# Altium schematic sheet MCU.SchDoc
size A3
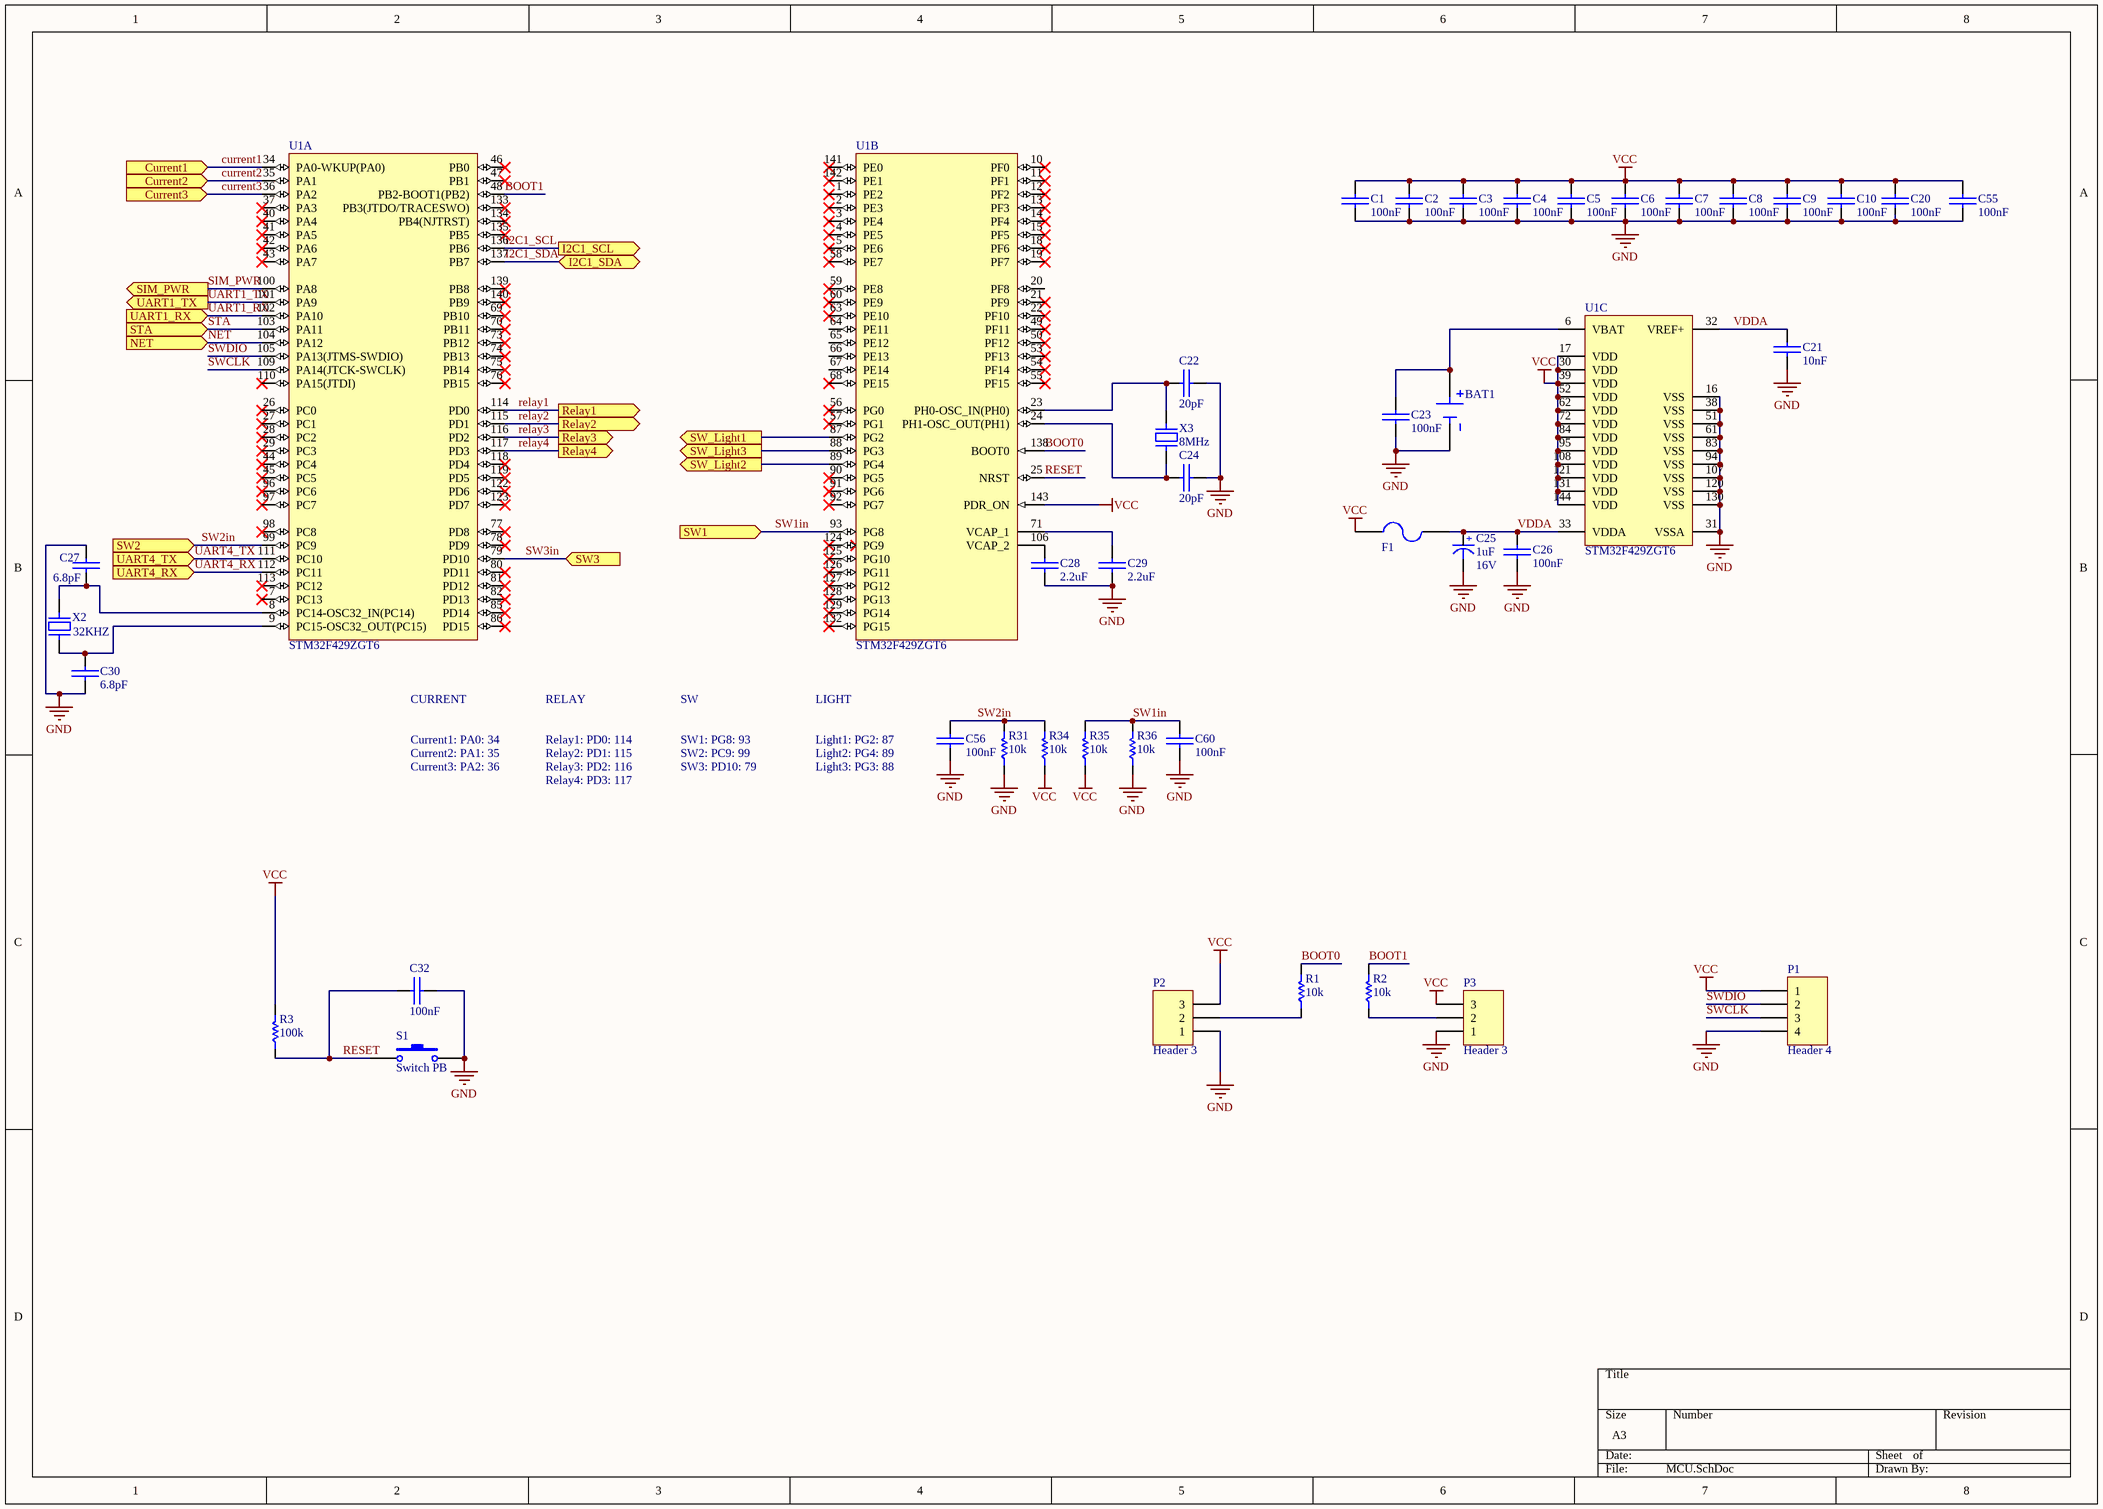
[diagram p0: MCU.SchDoc]

## Parts
BAT1  BAT  [BAT_STAND]  (value not drawn)
C1  100nF  [CAP 0603_1608]
C2  100nF  [CAP 0603_1608]
C3  100nF  [CAP 0603_1608]
C4  100nF  [CAP 0603_1608]
C5  100nF  [CAP 0603_1608]
C6  100nF  [CAP 0603_1608]
C7  100nF  [CAP 0603_1608]
C8  100nF  [CAP 0603_1608]
C9  100nF  [CAP 0603_1608]
C10  100nF  [CAP 0603_1608]
C20  100nF  [CAP 0603_1608]
C21  10nF  [CAP 0603_1608]
C22  20pF  [CAP 0805_2012]
C23  100nF  [CAP 0603_1608]
C24  20pF  [CAP 0805_2012]
C25  Voltage: 16V  [CAPP 1206 (3216X18L) Size A]  (hidden comment: 1uF)
C26  100nF  [CAP 0603_1608]
C27  6.8pF  [CAP 0805_2012]
C28  2.2uF  [CAP 0805_2012]
C29  2.2uF  [CAP 0805_2012]
C30  6.8pF  [CAP 0805_2012]
C32  100nF  [CAP 0603_1608]
C55  100nF  [CAP 0603_1608]
C56  100nF  [CAP 0805_2012]
C60  100nF  [CAP 0805_2012]
F1  Ferrite Bead  [FUSE_0805]  (value not drawn)
P1  Header 4  [HDR1X4]
P2  Header 3  [HDR1X3]
P3  Header 3  [HDR1X3]
R1  10k  [RES 0805_2012]
R2  10k  [RES 0805_2012]
R3  100k  [RES 0805_2012]
R31  10k  [RES 0805_2012]
R34  10k  [RES 0805_2012]
R35  10k  [RES 0805_2012]
R36  10k  [RES 0805_2012]
S1  Switch PB  [Switch - Push to On]
U1  STM32F429ZGT6  [LQFP144]  (parts A,B,C of 3)
X2  32KHZ  [IND 1206_3216]
X3  Parameter 1: 8MHz  [XTAL THD HC49]

## Ports
Current1 (in), Current2 (in), Current3 (in), I2C1_SCL (out), I2C1_SDA (bidir), NET (in), Relay1 (out), Relay2 (out), Relay3 (out), Relay4 (out), SIM_PWR (out), STA (in), SW1 (in), SW2 (in), SW3 (in), SW_Light1 (out), SW_Light2 (out), SW_Light3 (out), UART1_RX (in), UART1_TX (out), UART4_RX (in), UART4_TX (in)

## Nets
GND: BAT1.NEG C1.1(+) C2.1(+) C3.1(+) C4.1(+) C5.1(+) C6.1(+) C7.1(+) C8.1(+) C9.1(+) C10.1(+) C20.1(+) C21.1(+) C22.1(+) C23.1(+) C24.1(+) C25.2(-) C26.1(+) C27.1(+) C28.1(+) C29.1(+) C30.2(-) C32.1(+) C55.1(+) C56.1(+) C60.1(+) P1.4 P2.1 P3.1 R31.1 R36.1 S1.2 U1.16(VSS) U1.31(VSSA) U1.38(VSS) U1.51(VSS) U1.61(VSS) U1.83(VSS) U1.94(VSS) U1.107(VSS) U1.120(VSS) U1.130(VSS)
VCC: C1.2(-) C2.2(-) C3.2(-) C4.2(-) C5.2(-) C6.2(-) C7.2(-) C8.2(-) C9.2(-) C10.2(-) C20.2(-) C55.2(-) F1.1 P1.1 P2.3 P3.3 R3.2 R34.1 R35.1 U1.17(VDD) U1.30(VDD) U1.39(VDD) U1.52(VDD) U1.62(VDD) U1.72(VDD) U1.84(VDD) U1.95(VDD) U1.108(VDD) U1.121(VDD) U1.131(VDD) U1.143(PDR_ON) U1.144(VDD)
BOOT0: R1.2 U1.138(BOOT0)
BOOT1: R2.2 U1.48(PB2-BOOT1(PB2))
current1: U1.34(PA0-WKUP(PA0)) ; port Current1
current2: U1.35(PA1) ; port Current2
current3: U1.36(PA2) ; port Current3
I2C1_SCL: U1.136(PB6) ; port I2C1_SCL
I2C1_SDA: U1.137(PB7) ; port I2C1_SDA
NET: U1.104(PA12) ; port NET
relay1: U1.114(PD0) ; port Relay1
relay2: U1.115(PD1) ; port Relay2
relay3: U1.116(PD2) ; port Relay3
relay4: U1.117(PD3) ; port Relay4
RESET: C32.2(-) R3.1 S1.1 U1.25(NRST)
SIM_PWR: U1.100(PA8) ; port SIM_PWR
STA: U1.103(PA11) ; port STA
SW1in: C60.2(-) R35.2 R36.2 U1.93(PG8) ; port SW1
SW2in: C56.2(-) R31.2 R34.2 U1.99(PC9) ; port SW2
SW3in: U1.79(PD10) ; port SW3
SW_Light1: U1.87(PG2) ; port SW_Light1
SW_Light2: U1.89(PG4) ; port SW_Light2
SW_Light3: U1.88(PG3) ; port SW_Light3
SWCLK: P1.3 U1.109(PA14(JTCK-SWCLK))
SWDIO: P1.2 U1.105(PA13(JTMS-SWDIO))
UART1_RX: U1.102(PA10) ; port UART1_RX
UART1_TX: U1.101(PA9) ; port UART1_TX
UART4_RX: U1.112(PC11) ; port UART4_RX
UART4_TX: U1.111(PC10) ; port UART4_TX
VDDA: C21.2(-) C25.1(+) C26.2(-) F1.2 U1.32(VREF+) U1.33(VDDA)
NetBAT1_S+1: BAT1.S+1(POS) BAT1.S+2(POS) C23.2(-) U1.6(VBAT)
NetC22_2: C22.2(-) U1.23(PH0-OSC_IN(PH0)) X3.2
NetC24_2: C24.2(-) U1.24(PH1-OSC_OUT(PH1)) X3.1
NetC27_2: C27.2(-) U1.8(PC14-OSC32_IN(PC14)) X2.2
NetC28_2: C28.2(-) U1.106(VCAP_2)
NetC29_2: C29.2(-) U1.71(VCAP_1)
NetC30_1: C30.1(+) U1.9(PC15-OSC32_OUT(PC15)) X2.1
NetP2_2: P2.2 R1.1
NetP3_2: P3.2 R2.1

Not connected (* = marked no-connect by the designer): U1 1(PE2)* 2(PE3)* 3(PE4)* 4(PE5)* 5(PE6)* 7(PC13)* 10(PF0)* 11(PF1)* 12(PF2)* 13(PF3)* 14(PF4)* 15(PF5)* 18(PF6)* 19(PF7)* 20(PF8) 21(PF9)* 22(PF10)* 26(PC0)* 27(PC1)* 28(PC2)* 29(PC3)* 37(PA3)* 40(PA4)* 41(PA5)* 42(PA6)* 43(PA7)* 44(PC4)* 45(PC5)* 46(PB0)* 47(PB1)* 49(PF11)* 50(PF12)* 53(PF13)* 54(PF14)* 55(PF15)* 56(PG0)* 57(PG1)* 58(PE7)* 59(PE8)* 60(PE9)* 63(PE10)* 64(PE11) 65(PE12) 66(PE13) 67(PE14) 68(PE15)* 69(PB10)* 70(PB11)* 73(PB12)* 74(PB13)* 75(PB14)* 76(PB15)* 77(PD8)* 78(PD9)* 80(PD11)* 81(PD12)* 82(PD13)* 85(PD14)* 86(PD15)* 90(PG5)* 91(PG6)* 92(PG7)* 96(PC6)* 97(PC7)* 98(PC8)* 110(PA15(JTDI))* 113(PC12)* 118(PD4)* 119(PD5)* 122(PD6)* 123(PD7)* 124(PG9)* 125(PG10)* 126(PG11)* 127(PG12)* 128(PG13)* 129(PG14)* 132(PG15)* 133(PB3(JTDO/TRACESWO))* 134(PB4(NJTRST))* 135(PB5)* 139(PB8)* 140(PB9)* 141(PE0)* 142(PE1)*

## Notes on the sheet
- CURRENT
- RELAY
- SW
- LIGHT
- Current1: PA0: 34
- Current2: PA1: 35
- Current3: PA2: 36
- Relay1: PD0: 114
- Relay2: PD1: 115
- Relay3: PD2: 116
- Relay4: PD3: 117
- SW3: PD10: 79
- SW1: PG8: 93
- SW2: PC9: 99
- (near C56) Light2: PG4: 89
- (near C56) Light3: PG3: 88
- (near C56) Light1: PG2: 87

## Library data of the parts
BAT1 = BAT: BATTERY HOLDER COIN
C1-C10 C20-C24 C26-C30 C32 C55 C56 C60 = Cap-Bipolar: Bipolar Capacitor; Voltage: 100V; Designer: Saeid Jorablo; Organazation: ControTec; Adding Date: 1387/12/20
  C1-C10 C20 C23 C26 C32 C55 C56 C60: Value: 100nF
  C21: Value: 10nF
  C22 C24: Value: 20pF
  C27 C30: Value: 6.8pF
  C28 C29: Value: 2.2uF
C25 = Cap-Polar: Polar Capacitor; Designer: Saeid Jorablo; Organazation: ControTec; Adding Date: 1387/12/20; Value: 1uF
F1 = Fuse 0805: Value: Ferrite Bead
P1 = Header 4: Header, 4-Pin; LatestRevisionDate: 17-Jul-2002; LatestRevisionNote: Re-released for DXP Platform.; Publisher: Altium Limited
P2 P3 = Header 3: Header, 3-Pin; LatestRevisionDate: 17-Jul-2002; LatestRevisionNote: Re-released for DXP Platform.; Publisher: Altium Limited
R1-R3 R31 R34-R36 = Resistor
  R1 R2 R31 R34-R36: Value: 10k
  R3: Value: 100k
S1 = Switch PB: Push Button Switch
U1 = STM32F429ZGT6: ARM Cortex-M4 32-bit MCU+FPU, 225 DMIPS, 1024 kB Flash, 256 kB Internal RAM, 114 I/Os, 144-pin LQFP, -40 to 85 degC, Tray; Manufacturer: STMicroelectronics; D/A Converter: 2x12-bit; FLASH Size (Prog) (kB): 1024; I/Os (High Current): 114; Internal RAM Size (kB): 256; Operating Frequency(F) (Processor speed) (MHz): 180; Supply Voltage(Vcc) max (V): 3.6; Supply Voltage(Vcc) min (V): 1.8; DatasheetVersion: Rev. 2; PackageVersion: Rev. 4, 06/2013; PackageReference: LQFP144; PackageDescription: 144-Pin Low Profile Quad Flat Package, 20 x 20 mm Body, 0.5 mm Pitch; Core: ARM Cortex-M4; Packing: Tray; Mounting Technology: Surface Mount; PartNumber: STM32F429ZGT6; ComponentLink1Description: Manufacturer URL; ComponentLink1URL: http://www.st.com/web/en/home.html; ComponentLink2Description: Datasheet; ComponentLink2URL: http://www.st.com/st-web-ui/static/active/en/resource/technical/document/data_brief/DM00053488.pdf; ComponentLink3Description: Package Specification; ComponentLink3URL: http://www.st.com/st-web-ui/static/active/en/resource/technical/document/datasheet/DM00037051.pdf
X2 = Crystal HC-49S SMD: SMT Crystal; VALUE: 32KHZ
X3 = Crystal THD HC49: SMT Crystal